# Altium schematic sheet SubPSSerialControl.SchDoc
size A4; DocumentNumber: 2; SheetNumber: 2; SheetTotal: 7
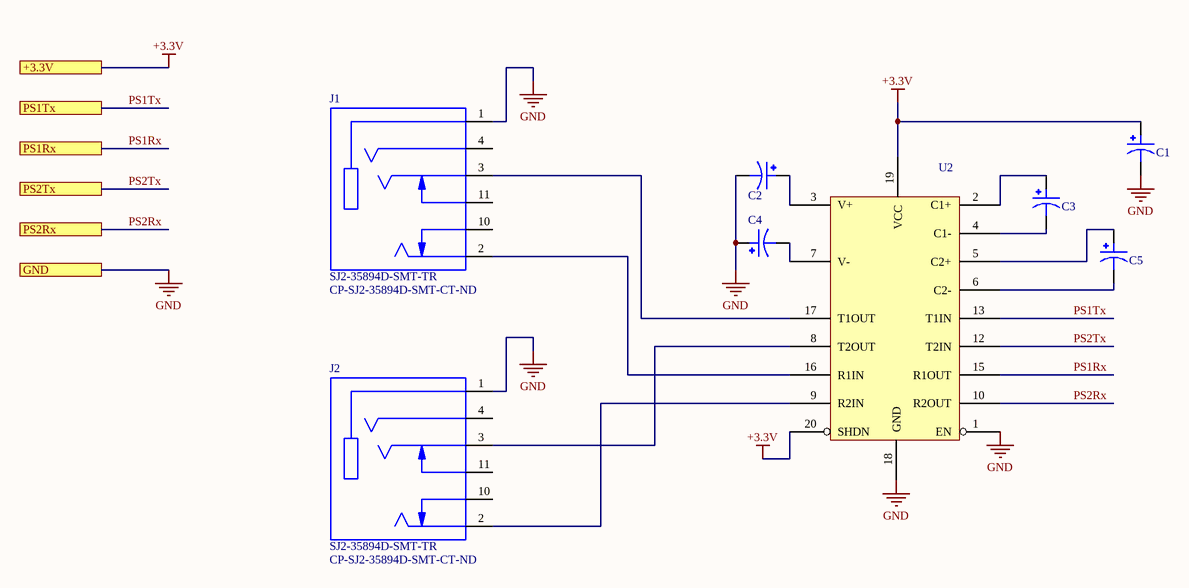
[diagram p0: SubPSSerialControl.SchDoc]

## Parts
C1  T491A104K050AT  [C1206]  (value not drawn)
C2  T491A104K050AT  [C1206]  (value not drawn)
C3  T491A104K050AT  [C1206]  (value not drawn)
C4  T491A104K050AT  [C1206]  (value not drawn)
C5  T491A104K050AT  [C1206]  (value not drawn)
J1  SJ2-35894D-SMT-TR  Supplier Part Number 1: CP-SJ2-35894D-SMT-CT-ND  [CUI_SJ2-35894D-SMT-TR]
J2  SJ2-35894D-SMT-TR  Supplier Part Number 1: CP-SJ2-35894D-SMT-CT-ND  [CUI_SJ2-35894D-SMT-TR]
U2  SP3222ECY-L/TR  [20-TSSOP]  (value not drawn)

## Ports
+3.3V, GND, PS1Rx, PS1Tx, PS2Rx, PS2Tx

## Nets
+3.3V: C1.1(POS) U2.19(VCC) U2.20(SHDN) ; port +3.3V
GND: C1.2(NEG) C2.2(NEG) C4.1(POS) J1.1(SLEEVE) J2.1(SLEEVE) U2.1(EN) U2.18(GND) ; port GND
PS1Rx: U2.15(R1OUT) ; port PS1Rx
PS1Tx: U2.13(T1IN) ; port PS1Tx
PS2Rx: U2.10(R2OUT) ; port PS2Rx
PS2Tx: U2.12(T2IN) ; port PS2Tx
NetC2_1: C2.1(POS) U2.3(V+)
NetC3_1: C3.1(POS) U2.2(C1+)
NetC3_2: C3.2(NEG) U2.4(C1-)
NetC4_2: C4.2(NEG) U2.7(V-)
NetC5_1: C5.1(POS) U2.5(C2+)
NetC5_2: C5.2(NEG) U2.6(C2-)
NetJ1_2: J1.2(TIP) U2.16(R1IN)
NetJ1_3: J1.3(RING1) U2.17(T1OUT)
NetJ2_2: J2.2(TIP) U2.9(R2IN)
NetJ2_3: J2.3(RING1) U2.8(T2OUT)

Not connected (* = marked no-connect by the designer): J1 4(RING2) 10(TIP_SWITCH) 11(RING1_SWITCH); J2 4(RING2) 10(TIP_SWITCH) 11(RING1_SWITCH)

## Notes on the sheet
- Title
- Size:
- Date:
- A4
- Number:
- Time:
- Revision:
- Sheet
- of
- File:

## Library data of the parts
C1-C5 = Cap_1206: Tantalium; Supplier 1: Digi-Key; Supplier Part Number 1: 399-8263-1-ND
J1 J2 = SJ2-35894D-SMT-TR: 3.5 mm, Stereo, Right Angle, Surface Mount _SMT_, Audio Jack Connector; MF: CUI Devices; Value: *; SnapEDA_Link: https://www.snapeda.com/parts/SJ2-35894D-SMT-TR/CUI%20Devices/view-part/1317816/?ref=snap; Package: None; MP: SJ2-35894D-SMT-TR; CUI_purchase_URL: https://www.cuidevices.com/product/interconnect/connectors/audio-connectors/jacks/sj2-3589x-smt-series?utm_source=snapeda.com&utm_medium=referral&utm_campaign=snapedaBOM; Availability: Unavailable; Price: None; Supplier 1: Digi-Key
U2 = SP3222e: The SP3222E and SP3232E series are RS-232 transceiver solutions / intended for portable or hand-held applications such as notebook / or palmtop computers.; Supplier 1: Digi-Key; Supplier Part Number 1: 1016-1792-2-ND